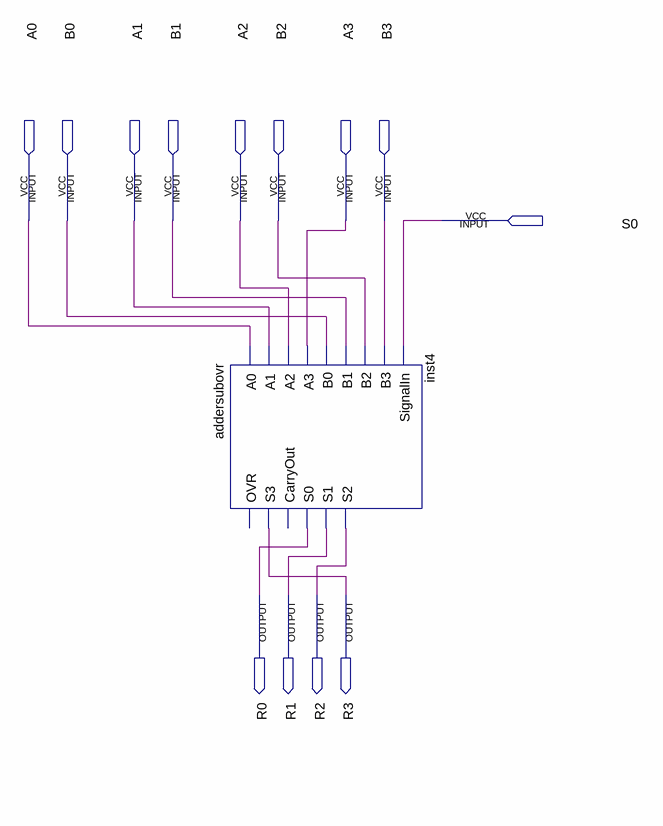
[diagram p0: schematic sheet]
// Quartus schematic adder.bdf as structural Verilog: 1 symbols, 13 pins
module adder (
  input  A0,
  input  B0,
  input  A1,
  input  B1,
  input  A2,
  input  B2,
  input  A3,
  input  B3,
  input  S0,
  output R0,
  output R1,
  output R2,
  output R3
);

  addersubovr inst4 (
    .A0(A0), .A1(A1), .A2(A2), .A3(A3), .B0(B0), .B1(B1), .B2(B2), .B3(B3), .SignalIn(S0), .S3(R3), .S0(R0),
    .S1(R1), .S2(R2));  // open: OVR, CarryOut
endmodule
